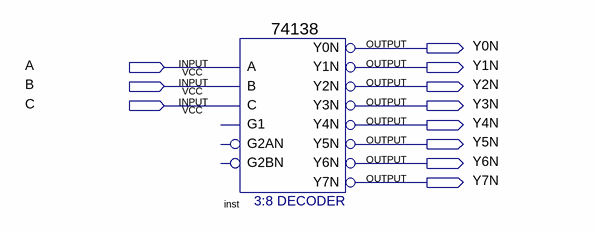
[diagram p0: schematic sheet]
// Quartus schematic 38yima.bdf as structural Verilog: 1 symbols, 11 pins
module \38yima  (
  input  A,
  input  B,
  input  C,
  output Y0N,
  output Y1N,
  output Y2N,
  output Y3N,
  output Y4N,
  output Y5N,
  output Y6N,
  output Y7N
);

  \74138  inst (
    .A(A), .B(B), .C(C), .Y0N(Y0N), .Y1N(Y1N), .Y2N(Y2N), .Y3N(Y3N), .Y4N(Y4N), .Y5N(Y5N), .Y6N(Y6N),
    .Y7N(Y7N));  // open: G1, G2AN, G2BN
endmodule
